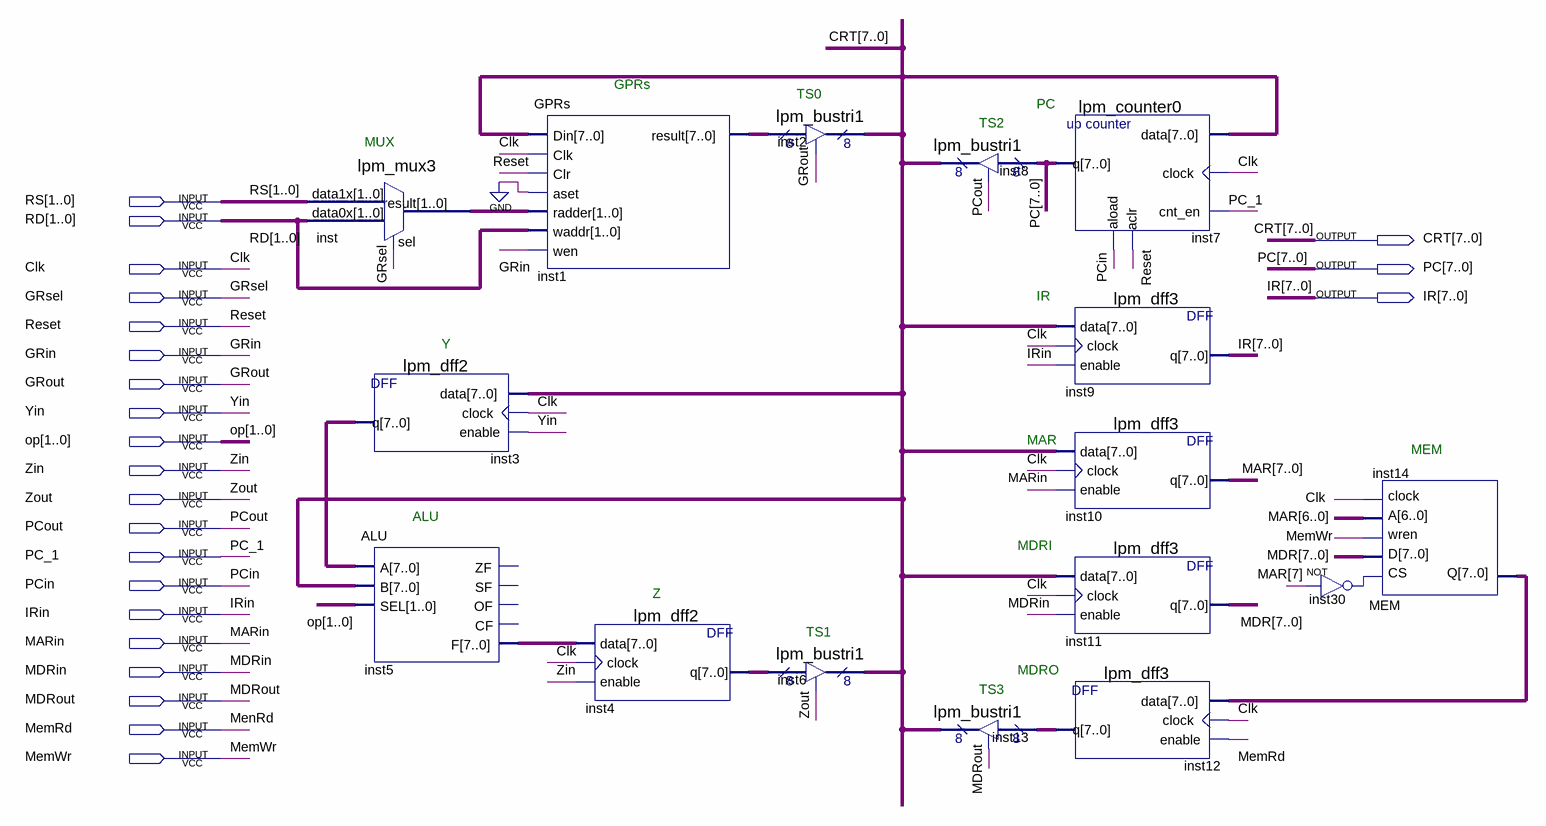
[diagram p0: schematic sheet]
// Quartus schematic Demo.bdf as structural Verilog: 16 symbols, 23 pins
module Demo (
  input  [1:0] RS,
  input  [1:0] RD,
  input  Clk,
  input  GRsel,
  input  Reset,
  input  GRin,
  input  GRout,
  input  Yin,
  input  [1:0] op,
  input  Zin,
  input  Zout,
  input  PCout,
  input  PC_1,
  input  PCin,
  input  IRin,
  input  MARin,
  input  MDRin,
  input  MDRout,
  input  MemRd,
  input  MemWr,
  output [7:0] CRT,
  output [7:0] PC,
  output [7:0] IR
);

  wire inst30_out;
  wire [1:0] inst_result;
  wire [7:0] inst1_result, inst3_q, inst4_q, inst5_f, inst12_q, inst14_q, MAR, MDR;

  lpm_mux3 inst (.data1x(RS), .data0x(RD), .sel(GRsel), .result(inst_result));
  lpm_dff2 inst3 (.data(CRT), .clock(Clk), .enable(Yin), .q(inst3_q));
  ALU inst5 (.A(inst3_q), .B(CRT), .SEL(op), .F(inst5_f));  // open: ZF, SF, OF, CF
  GPRs inst1 (
    .Din(CRT), .Clk(Clk), .Clr(Reset), .aset(1'b0), .radder(inst_result), .waddr(RD), .wen(GRin),
    .result(inst1_result));
  lpm_dff2 inst4 (.data(inst5_f), .clock(Clk), .enable(Zin), .q(inst4_q));
  lpm_bustri1 inst2 (.enabledt(GRout), .data(inst1_result), .tridata(CRT));
  lpm_bustri1 inst6 (.enabledt(Zout), .data(inst4_q), .tridata(CRT));
  lpm_bustri1 inst8 (.enabledt(PCout), .data(PC), .tridata(CRT));
  lpm_bustri1 inst13 (.enabledt(MDRout), .data(inst12_q), .tridata(CRT));
  lpm_counter0 inst7 (.data(CRT), .clock(Clk), .cnt_en(PC_1), .aclr(Reset), .aload(PCin), .q(PC));
  lpm_dff3 inst9 (.data(CRT), .clock(Clk), .enable(IRin), .q(IR));
  lpm_dff3 inst10 (.data(CRT), .clock(Clk), .enable(MARin), .q(MAR));
  lpm_dff3 inst11 (.data(CRT), .clock(Clk), .enable(MDRin), .q(MDR));
  lpm_dff3 inst12 (.data(inst14_q), .clock(Clk), .enable(MemRd), .q(inst12_q));
  not inst30 (inst30_out, MAR[7]);
  MEM inst14 (.CS(inst30_out), .D(MDR), .wren(MemWr), .A(MAR[6:0]), .clock(Clk), .Q(inst14_q));

  // Other names for the same wires on the sheet: MenRd = MemRd

  // Notes on the sheet:
  //   GPRs
  //   TS0
  //   PC
  //   TS2
  //   MUX
  //   IR
  //   Y
  //   MAR
  //   MEM
  //   ALU
  //   MDRI
  //   Z
  //   TS1
  //   MDRO
  //   TS3
endmodule
